# EAGLE design Bored (EAGLE 8.4.1)
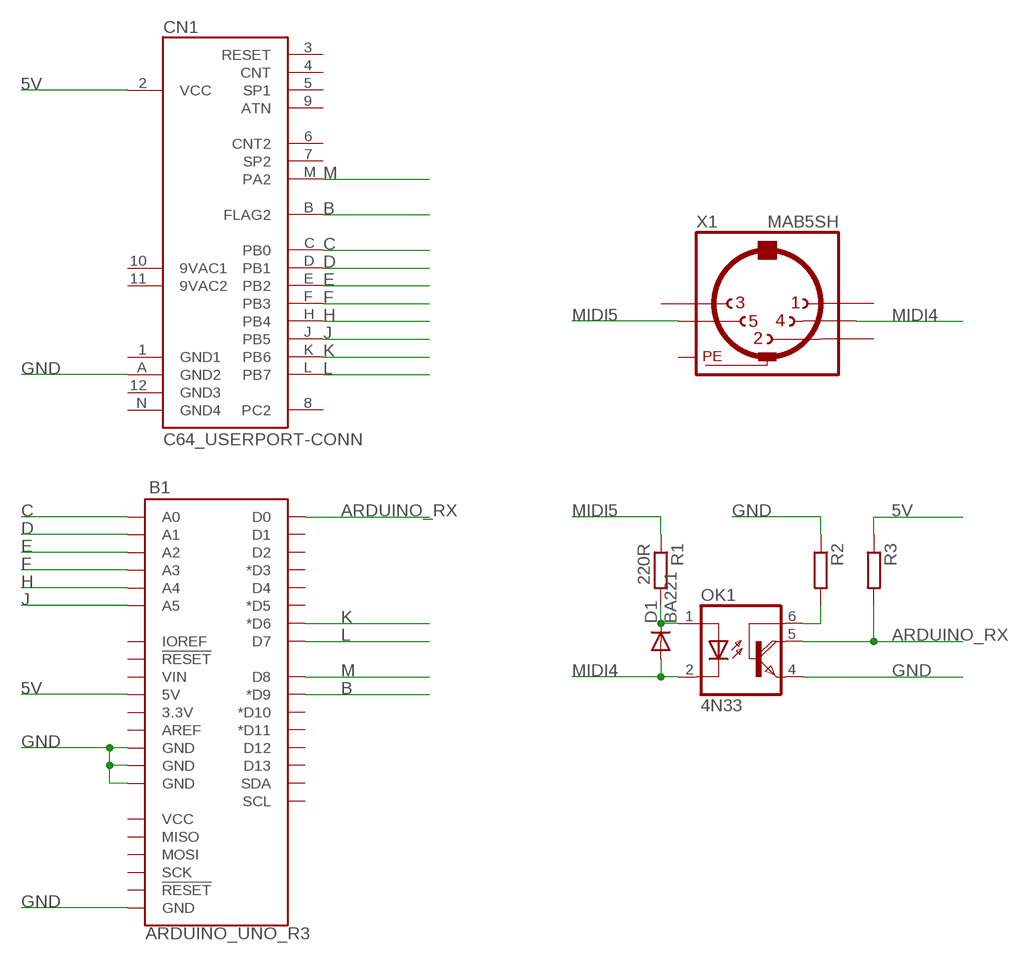
[diagram p0: schematic, sheet 1]

## Parts
B1  ARDUINO_UNO_R3  [ARDUINO_R3]
CN1  C64_USERPORT-CONN  [UPS24CONN]
D1  BA221  [DO35-10]
OK1  4N33  [DIL06]
R1  220R  R-EU_0207/10  [0207/10]
R2  R-EU_0207/10  [0207/10]
R3  R-EU_0207/10  [0207/10]
X1  MAB5SH  [MAB5SH]

## Nets
5V: B1.5V CN1.2(VCC) R3.1
ARDUINO_RX: B1.D0 OK1.5(COL) R3.2
B: B1.D9(*D9) CN1.B(FLAG2)
C: B1.A0 CN1.C(PB0)
D: B1.A1 CN1.D(PB1)
E: B1.A2 CN1.E(PB2)
F: B1.A3 CN1.F(PB3)
GND: B1.GND@1(GND) B1.GND@2(GND) B1.GND@3(GND) B1.GND@4(GND) CN1.A(GND2) OK1.4(E) R2.1
H: B1.A4 CN1.H(PB4)
J: B1.A5 CN1.J(PB5)
K: B1.D6(*D6) CN1.K(PB6)
L: B1.D7 CN1.L(PB7)
M: B1.D8 CN1.M(PA2)
MIDI4: D1.A OK1.2(C) X1.4
MIDI5: R1.1 X1.5
N$1: D1.C OK1.1(A) R1.2
N$4: OK1.6(B) R2.2
Unconnected: B1.3.3V B1.AREF B1.D1 B1.D2 B1.D3(*D3) B1.D4 B1.D5(*D5) B1.D10(*D10) B1.D11(*D11) B1.D12 B1.D13 B1.IOREF B1.MISO B1.MOSI B1.RESET@1(!RESET!) B1.RESET@2(!RESET!) B1.SCK B1.SCL B1.SDA B1.VCC B1.VIN CN1.1(GND1) CN1.3(RESET) CN1.4(CNT) CN1.5(SP1) CN1.6(CNT2) CN1.7(SP2) CN1.8(PC2) CN1.9(ATN) CN1.10(9VAC1) CN1.11(9VAC2) CN1.12(GND3) CN1.N(GND4) X1.1 X1.2 X1.3

## Power pins joined to a net without a drawn wire
PE: X1.PE X1.PE@(PE)

## Library data of the parts
B1 = SparkFun-Boards:ARDUINO_UNO_R3: Arduino R3 Footprint with SPI header Arduino Uno R3 Compatible Footprint. Matches PCB size of the original board. SparkFun Products: SAMD21 Dev Breakout <https://www.sparkfun.com/products/13672> RedBoard <https://www.sparkfun.com/products/12757> R3 Stackable Headers <https://www.sparkfun.com/products/11417>
CN1 = commodore:C64_USERPORT-CONN: This lib is created by Ruud Baltissen.
D1 = diode:BA221: DIODE high speed (Philips)
OK1 = optocoupler:4N33: MOTOROLA OPTO COUPLER; MF: VISHAY/TELEFUNKEN; MPN: 4N33; OC_FARNELL: 1469601; OC_NEWARK: 88K1390
R1-R3 = resistor:R-EU_: RESISTOR, European symbol
X1 = con-hirschmann:MAB5SH: Female CONNECTOR 5 pins 90 deg. with shield, horizontal (DIN 41524); OC_FARNELL: 809883; OC_NEWARK: unknown

## Net classes
0 default: width 0.61 mm

## Board
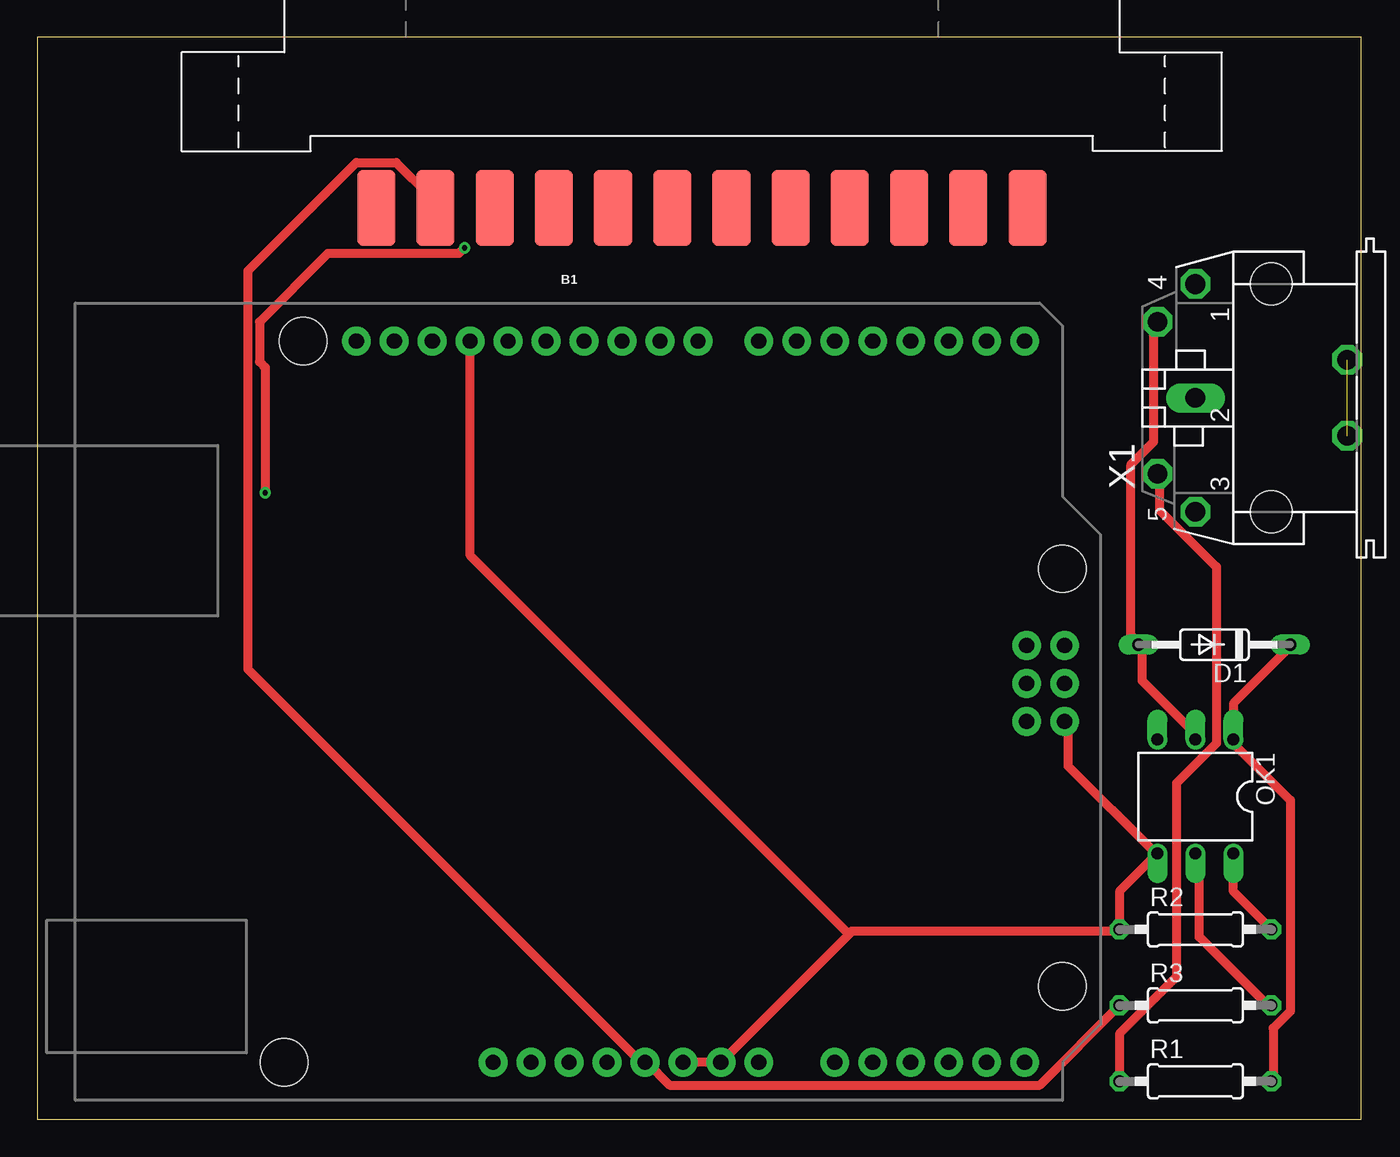
[diagram p1: board, top side]
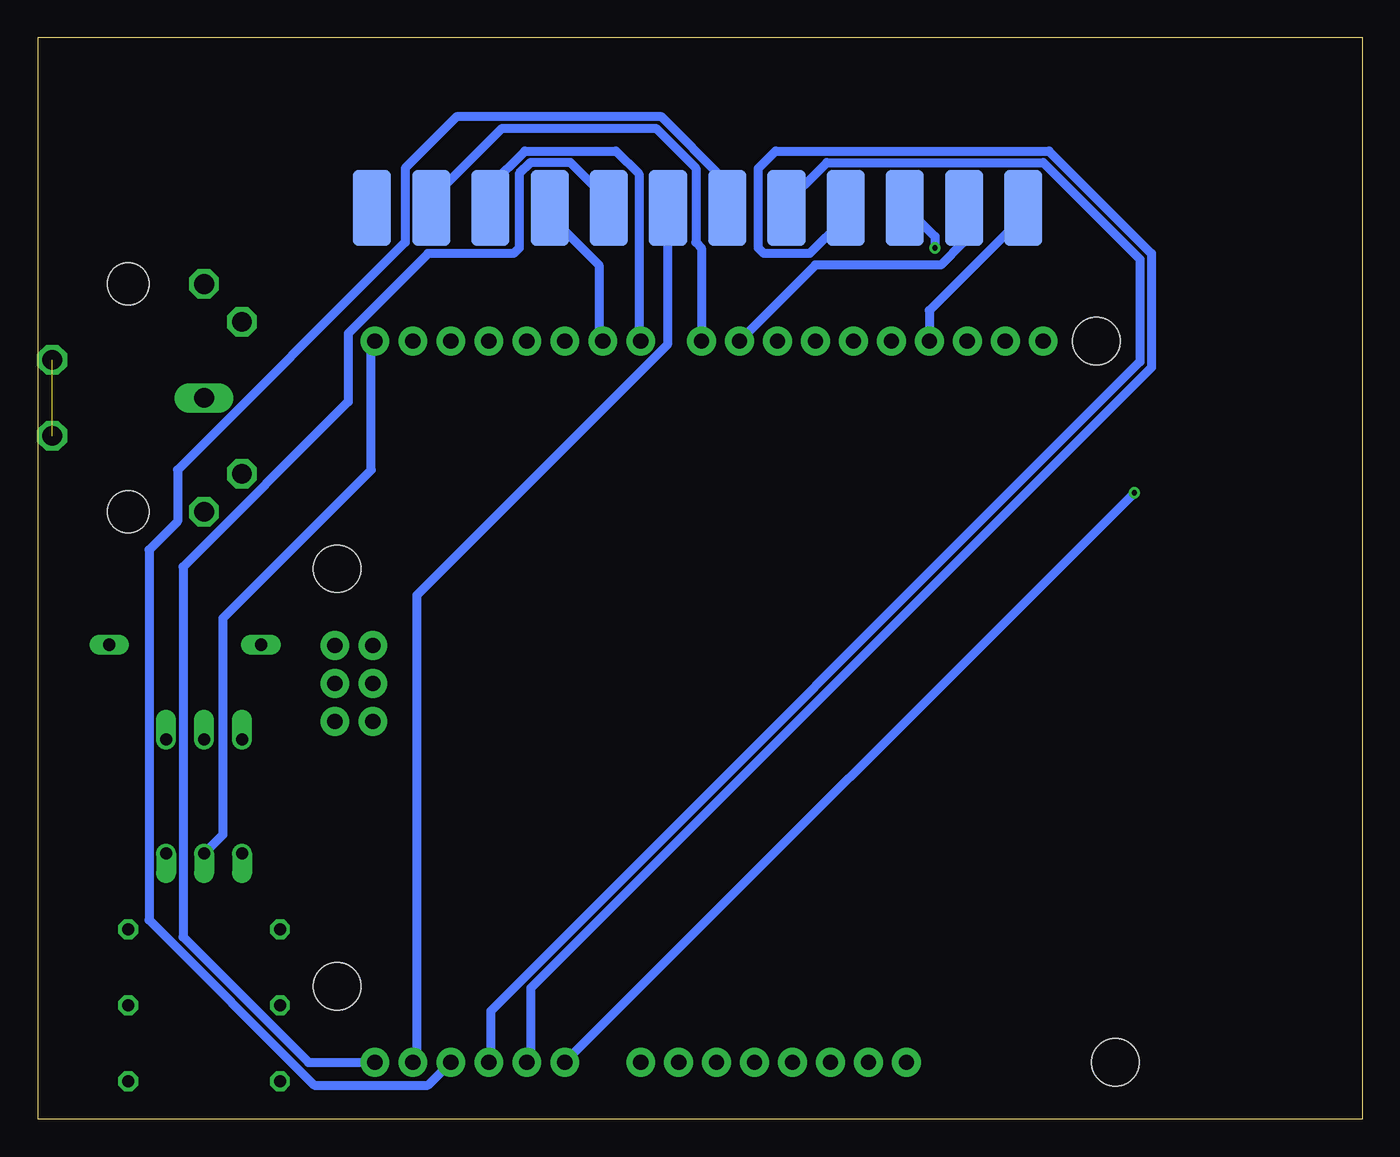
[diagram p2: board, bottom side, seen from below]

Size 88.57 x 72.38 mm. Coordinates in mm from the lower left corner, seen from the top.
Outline: 0,0 88.57,0 88.57,72.38 0,72.38 0,0
Copper layers (1*16): Top 0.035mm / dielectric 1.5mm / Bottom 0.035mm
Design rules "default": minimum track width 6mil, minimum drill 0.35mm, track to track 6mil, track to pad 6mil, pad to pad 6mil, via to via 6mil, smd to smd 6mil, copper to edge 40mil, drill to drill 6mil, minimum pad ring 10mil, minimum via ring 8mil, stop-mask expansion 4mil, vias tented up to drill 0mil, thermal gap 10mil

### Footprints (pad centres in the part's own frame; a part is rotated, then mirrored left to right if it is on the bottom)
ARDUINO_R3 = drill 1.016 pad 1.93: 3.3V 2.54,-24.13; 5V 5.08,-24.13; A0 17.78,-24.13; A1 20.32,-24.13; A2 22.86,-24.13; A3 25.4,-24.13; A4 27.94,-24.13; A5 30.48,-24.13; AREF -9.144,24.13; D0 30.48,24.13; D1 27.94,24.13; D2 25.4,24.13; D3 22.86,24.13; D4 20.32,24.13; D5 17.78,24.13; D6 15.24,24.13; D7 12.7,24.13; D8 8.636,24.13; D9 6.096,24.13; D10 3.556,24.13; D11 1.016,24.13; D12 -1.524,24.13; D13 -4.064,24.13; GND@1 7.62,-24.13; GND@2 10.16,-24.13; GND@3 -6.604,24.13; GND@4 33.16,-1.32; IOREF -2.54,-24.13; MISO 30.62,3.76; MOSI 33.16,1.22; NC -5.08,-24.13; RESET@1 0,-24.13; RESET@2 30.62,-1.32; SCK 30.62,1.22; SCL -14.224,24.13; SDA -11.684,24.13; VCC 33.16,3.76; VIN 12.7,-24.13 | hole 3.175: -17.78,24.13; 33.02,8.89; 33.02,-19.05; -19.05,-24.13
UPS24CONN = smd 2.54 x 5.08: 1 -21.779,-1.27; 2 -17.819,-1.27; 3 -13.859,-1.27; 4 -9.899,-1.27; 5 -5.939,-1.27; 6 -1.979,-1.27; 7 1.981,-1.27; 8 5.941,-1.27; 9 9.901,-1.27; 10 13.861,-1.27; 11 17.821,-1.27; 12 21.781,-1.27 | smd 2.54 x 5.08 bottom: A -21.779,-1.27; B -17.819,-1.27; C -13.859,-1.27; D -9.899,-1.27; E -5.939,-1.27; F -1.979,-1.27; H 1.981,-1.27; J 5.941,-1.27; K 9.901,-1.27; L 13.861,-1.27; M 17.821,-1.27; N 21.781,-1.27
DO35-10 = drill 0.813 long: A 5.08,0; C -5.08,0
DIL06 = drill 0.813 offset: 1 -2.54,-3.81; 2 0,-3.81; 3 2.54,-3.81; 4 2.54,3.81; 5 0,3.81; 6 -2.54,3.81
0207/10 = drill 0.813 octagon: 1 -5.08,0; 2 5.08,0
MAB5SH = drill 1.321 octagon: 1 7.62,5.08; 3 -7.62,5.08; 4 5.08,7.62; 5 -5.08,7.62; PE -2.54,-5.08; PE@ 2.54,-5.08 | drill 1.321 long: 2 0,5.08 | hole 2.794: 7.62,0; -7.62,0

### Placement (x,y rotation side)
B1  35.56,27.94 0 top
CN1  44.45,62.23 0 top
D1  78.74,31.75 180 top
OK1  77.47,21.59 180 top
R1  77.47,2.54 0 top
R2  77.47,12.7 0 top
R3  77.47,7.62 0 top
X1  82.55,48.26 90 top

### Tracks (layer width: path | path; a pad name or v marks a point on that pad's centre or on a via)
5V
  Top 0.61: R3.1 67.06,2.29 42.29,2.29 40.77,3.81 B1.5V 40.39,3.81 14.1,30.1 14.1,56.77 21.34,64.01 24,64.01 26.29,61.72 26.29,60.96 CN1.2
ARDUINO_RX
  Top 0.61: OK1.5 77.72,17.53 77.72,12.19 82.3,7.62 R3.2
  Bottom 0.61: OK1.5 76.2,19.05 76.2,33.53 66.29,43.43 66.29,51.82 B1.D0
B
  Bottom 0.61: B1.D9 36.58,57.15 28.19,57.15 26.67,58.67 26.67,60.96 CN1.B
C  (via drill 0.35)
  Top 0.61: v15.24,41.91 15.24,50.29 14.86,50.67 14.86,53.34 19.43,57.91 28.19,57.91 v28.57,58.29
  Bottom 0.61: v15.24,41.91 B1.A0 | v28.57,58.29 28.57,59.05 30.48,60.96 CN1.C
D
  Bottom 0.61: B1.A1 55.63,3.81 55.63,8.76 14.1,50.29 14.1,57.91 20.95,64.77 39.24,64.77 40.39,63.63 40.39,58.29 40.01,57.91 36.96,57.91 34.67,60.2 34.67,60.96 CN1.D
E
  Bottom 0.61: B1.A2 58.29,3.81 58.29,7.24 14.86,50.67 14.86,57.53 21.34,64.01 35.81,64.01 38.86,60.96 CN1.E
F
  Bottom 0.61: B1.A3 62.48,2.29 70.1,2.29 81.15,13.33 81.15,38.1 79.25,40.01 79.25,43.43 64.01,58.67 64.01,63.63 60.58,67.06 46.86,67.06 42.67,62.87 42.67,60.96 CN1.F
GND
  Top 0.61: B1.GND@1 B1.GND@2 54.29,12.38 | B1.GND@4 68.96,26.29 68.96,23.62 74.68,17.91 OK1.4 72.39,15.24 R2.1 72.39,12.57 54.48,12.57 54.29,12.38 | B1.GND@3 28.96,37.72 54.29,12.38
  Bottom 0.61: B1.GND@3 28.96,54.1 22.86,60.2 22.86,60.96 CN1.A
H
  Bottom 0.61: B1.A4 63.25,3.81 63.25,35.05 46.48,51.82 46.48,60.96 CN1.H
J
  Bottom 0.61: B1.A5 70.48,3.81 78.87,12.19 78.87,36.96 67.82,48.01 67.82,52.58 62.48,57.91 56.77,57.91 56.39,58.29 56.39,63.25 55.63,64.01 52.96,64.01 50.67,61.72 50.67,60.96 CN1.J
K
  Bottom 0.61: B1.D6 51.05,52.2 51.05,57.15 54.1,60.2 54.1,60.96 CN1.K
L
  Bottom 0.61: B1.D7 48.39,52.2 48.39,63.25 49.91,64.77 56.01,64.77 58.29,62.48 58.29,60.96 CN1.L
M
  Bottom 0.61: B1.D8 44.2,58.29 44.58,58.67 44.58,63.63 47.24,66.29 57.53,66.29 62.1,61.72 62.1,60.96 CN1.M
MIDI4
  Top 0.61: OK1.2 77.72,25.53 73.91,29.34 73.91,31.62 D1.A 73.53,32 73.15,32.39 73.15,43.82 74.68,45.34 74.68,53.34 X1.4
MIDI5
  Top 0.61: R1.1 72.39,5.72 76.2,9.52 76.2,22.48 78.87,25.15 78.87,36.96 75.06,40.77 75.06,43.05 X1.5
N$1
  Top 0.61: D1.C 83.82,31.62 80.01,27.81 OK1.1 80.01,25.15 83.82,21.34 83.82,7.24 82.68,6.1 82.68,2.67 R1.2
N$4
  Top 0.61: OK1.6 80.01,15.24 R2.2
PE  (1 unrouted)